# EAGLE schematic eeZee Crystal (EAGLE 6.4)
DATABASE: ./../PARTSDB.TXT
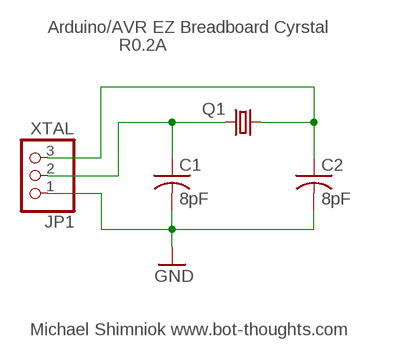
[diagram p0: schematic, sheet 1]

## Parts
C1  8pF  C-USC0603  [C0603]
C2  8pF  C-USC0603  [C0603]
JP1  XTAL  PINHD-1X03_2.54-S  [1X03-S]
Q1  CRYSTALNDK5X3  [NDK_2PAD_5X3]

## Nets
GND: C1.2 C2.2 JP1.1
N$2: C1.1 JP1.2 Q1.P$2
N$3: C2.1 JP1.3 Q1.P$1

## Notes on the sheet
- Arduino/AVR EZ Breadboard Cyrstal
- R0.2A
- Michael Shimniok www.bot-thoughts.com

## Library data of the parts
C1 C2 = rcl:C-US: CAPACITOR, American symbol; BOM: INCLUDE; PARTNO: C1608C0G1H080D
JP1 = pinhead-2:PINHD-1X03: PIN HEADER; BOM: EXCLUDE
Q1 = mes_crystal:CRYSTAL: CRYSTAL; PARTNO: NX5032GA-16.000000MHZ-LN-CD-1